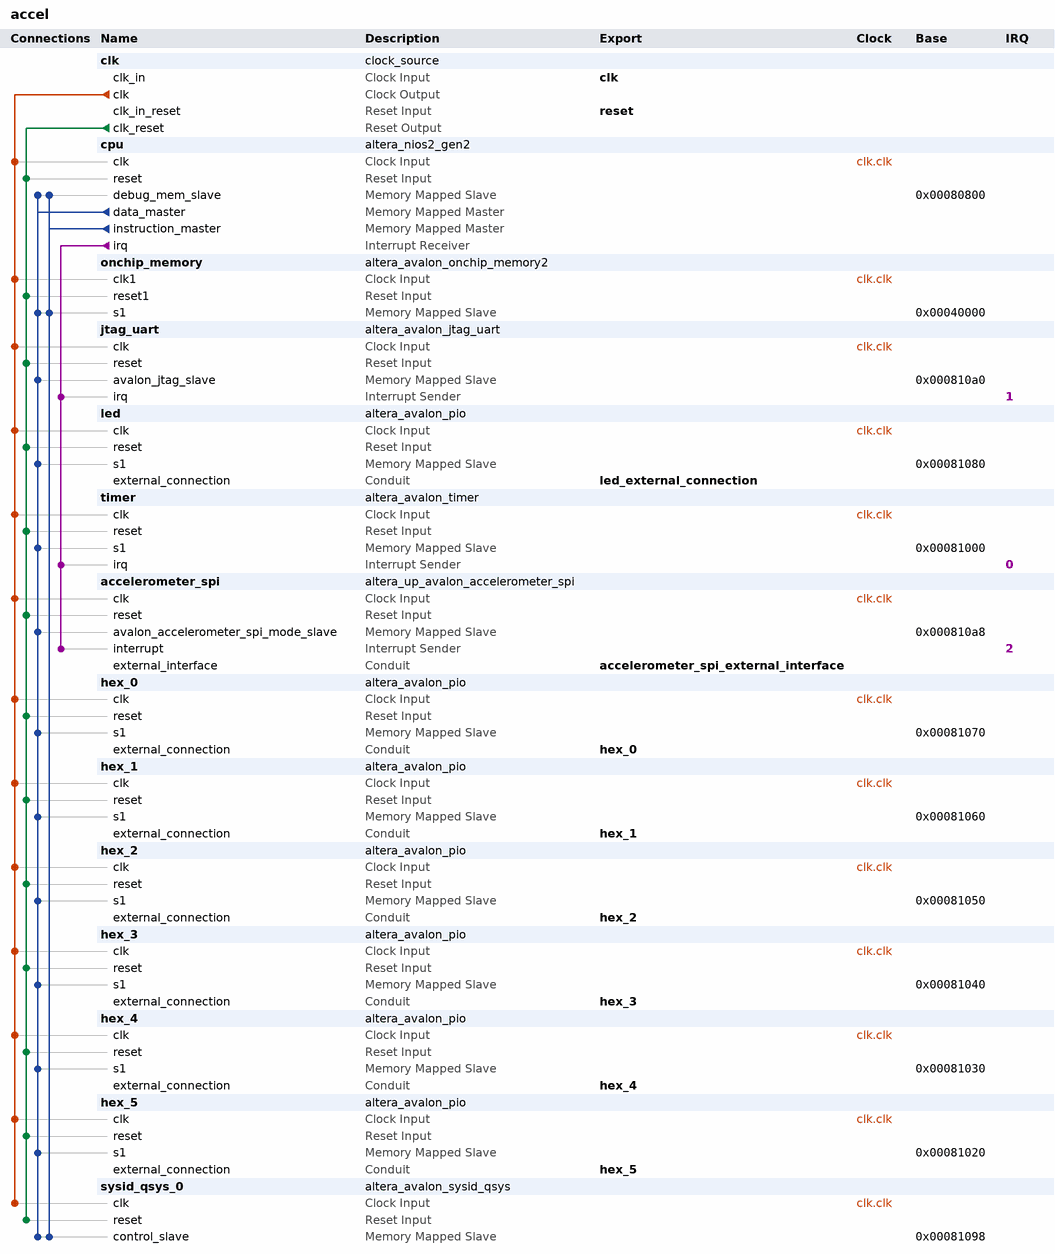
[diagram p0: system contents]
# Platform Designer (Qsys) system accel, MAX 10 10M50DAF484C7G
# Parameters at their usual value, and those the tool derives, are not listed.
package require -exact qsys 22.1
create_system accel
set_project_property DEVICE_FAMILY {MAX 10}
set_project_property DEVICE 10M50DAF484C7G

add_instance clk clock_source 22.1
set_instance_parameter_value clk clockFrequency 50000000

add_instance cpu altera_nios2_gen2 22.1
set_instance_parameter_value cpu dcache_size 2048
set_instance_parameter_value cpu exceptionSlave onchip_memory.s1
set_instance_parameter_value cpu icache_size 4096
set_instance_parameter_value cpu impl Tiny
set_instance_parameter_value cpu resetSlave onchip_memory.s1

add_instance onchip_memory altera_avalon_onchip_memory2 22.1
set_instance_parameter_value onchip_memory dataWidth 32
set_instance_parameter_value onchip_memory dualPort false
set_instance_parameter_value onchip_memory initMemContent false
set_instance_parameter_value onchip_memory initializationFileName onchip_mem.hex
set_instance_parameter_value onchip_memory memorySize 150000

add_instance jtag_uart altera_avalon_jtag_uart 22.1
set_instance_parameter_value jtag_uart simInteractiveOptions NO_INTERACTIVE_WINDOWS

add_instance led altera_avalon_pio 22.1
set_instance_parameter_value led direction Output
set_instance_parameter_value led width 10

add_instance timer altera_avalon_timer 22.1
set_instance_parameter_value timer period 1
set_instance_parameter_value timer periodUnits MSEC

add_instance accelerometer_spi altera_up_avalon_accelerometer_spi 18.0

add_instance hex_0 altera_avalon_pio 22.1
set_instance_parameter_value hex_0 direction Output
set_instance_parameter_value hex_0 width 7

add_instance hex_1 altera_avalon_pio 22.1
set_instance_parameter_value hex_1 direction Output
set_instance_parameter_value hex_1 width 7

add_instance hex_2 altera_avalon_pio 22.1
set_instance_parameter_value hex_2 direction Output
set_instance_parameter_value hex_2 width 7

add_instance hex_3 altera_avalon_pio 22.1
set_instance_parameter_value hex_3 direction Output
set_instance_parameter_value hex_3 width 7

add_instance hex_4 altera_avalon_pio 22.1
set_instance_parameter_value hex_4 direction Output
set_instance_parameter_value hex_4 width 7

add_instance hex_5 altera_avalon_pio 22.1
set_instance_parameter_value hex_5 direction Output
set_instance_parameter_value hex_5 width 7

add_instance sysid_qsys_0 altera_avalon_sysid_qsys 22.1
set_instance_parameter_value sysid_qsys_0 id 0

# connections
add_connection clk.clk accelerometer_spi.clk clock
add_connection clk.clk cpu.clk clock
add_connection clk.clk hex_0.clk clock
add_connection clk.clk hex_1.clk clock
add_connection clk.clk hex_2.clk clock
add_connection clk.clk hex_3.clk clock
add_connection clk.clk hex_4.clk clock
add_connection clk.clk hex_5.clk clock
add_connection clk.clk jtag_uart.clk clock
add_connection clk.clk led.clk clock
add_connection clk.clk onchip_memory.clk1 clock
add_connection clk.clk sysid_qsys_0.clk clock
add_connection clk.clk timer.clk clock
add_connection clk.clk_reset accelerometer_spi.reset reset
add_connection clk.clk_reset cpu.reset reset
add_connection clk.clk_reset hex_0.reset reset
add_connection clk.clk_reset hex_1.reset reset
add_connection clk.clk_reset hex_2.reset reset
add_connection clk.clk_reset hex_3.reset reset
add_connection clk.clk_reset hex_4.reset reset
add_connection clk.clk_reset hex_5.reset reset
add_connection clk.clk_reset jtag_uart.reset reset
add_connection clk.clk_reset led.reset reset
add_connection clk.clk_reset onchip_memory.reset1 reset
add_connection clk.clk_reset sysid_qsys_0.reset reset
add_connection clk.clk_reset timer.reset reset
add_connection cpu.data_master accelerometer_spi.avalon_accelerometer_spi_mode_slave avalon
set_connection_parameter_value cpu.data_master/accelerometer_spi.avalon_accelerometer_spi_mode_slave baseAddress 0x000810a8
add_connection cpu.data_master cpu.debug_mem_slave avalon
set_connection_parameter_value cpu.data_master/cpu.debug_mem_slave baseAddress 0x00080800
add_connection cpu.data_master hex_0.s1 avalon
set_connection_parameter_value cpu.data_master/hex_0.s1 baseAddress 0x00081070
add_connection cpu.data_master hex_1.s1 avalon
set_connection_parameter_value cpu.data_master/hex_1.s1 baseAddress 0x00081060
add_connection cpu.data_master hex_2.s1 avalon
set_connection_parameter_value cpu.data_master/hex_2.s1 baseAddress 0x00081050
add_connection cpu.data_master hex_3.s1 avalon
set_connection_parameter_value cpu.data_master/hex_3.s1 baseAddress 0x00081040
add_connection cpu.data_master hex_4.s1 avalon
set_connection_parameter_value cpu.data_master/hex_4.s1 baseAddress 0x00081030
add_connection cpu.data_master hex_5.s1 avalon
set_connection_parameter_value cpu.data_master/hex_5.s1 baseAddress 0x00081020
add_connection cpu.data_master jtag_uart.avalon_jtag_slave avalon
set_connection_parameter_value cpu.data_master/jtag_uart.avalon_jtag_slave baseAddress 0x000810a0
add_connection cpu.data_master led.s1 avalon
set_connection_parameter_value cpu.data_master/led.s1 baseAddress 0x00081080
add_connection cpu.data_master onchip_memory.s1 avalon
set_connection_parameter_value cpu.data_master/onchip_memory.s1 baseAddress 0x00040000
add_connection cpu.data_master sysid_qsys_0.control_slave avalon
set_connection_parameter_value cpu.data_master/sysid_qsys_0.control_slave baseAddress 0x00081098
add_connection cpu.data_master timer.s1 avalon
set_connection_parameter_value cpu.data_master/timer.s1 baseAddress 0x00081000
add_connection cpu.instruction_master cpu.debug_mem_slave avalon
set_connection_parameter_value cpu.instruction_master/cpu.debug_mem_slave baseAddress 0x00080800
add_connection cpu.instruction_master onchip_memory.s1 avalon
set_connection_parameter_value cpu.instruction_master/onchip_memory.s1 baseAddress 0x00040000
add_connection cpu.instruction_master sysid_qsys_0.control_slave avalon
set_connection_parameter_value cpu.instruction_master/sysid_qsys_0.control_slave baseAddress 0x00081098
add_connection cpu.irq accelerometer_spi.interrupt interrupt
set_connection_parameter_value cpu.irq/accelerometer_spi.interrupt irqNumber 2
add_connection cpu.irq jtag_uart.irq interrupt
set_connection_parameter_value cpu.irq/jtag_uart.irq irqNumber 1
add_connection cpu.irq timer.irq interrupt
set_connection_parameter_value cpu.irq/timer.irq irqNumber 0

# exported interfaces
add_interface accelerometer_spi_external_interface conduit end
set_interface_property accelerometer_spi_external_interface EXPORT_OF accelerometer_spi.external_interface
add_interface clk clock sink
set_interface_property clk EXPORT_OF clk.clk_in
add_interface hex_0 conduit end
set_interface_property hex_0 EXPORT_OF hex_0.external_connection
add_interface hex_1 conduit end
set_interface_property hex_1 EXPORT_OF hex_1.external_connection
add_interface hex_2 conduit end
set_interface_property hex_2 EXPORT_OF hex_2.external_connection
add_interface hex_3 conduit end
set_interface_property hex_3 EXPORT_OF hex_3.external_connection
add_interface hex_4 conduit end
set_interface_property hex_4 EXPORT_OF hex_4.external_connection
add_interface hex_5 conduit end
set_interface_property hex_5 EXPORT_OF hex_5.external_connection
add_interface led_external_connection conduit end
set_interface_property led_external_connection EXPORT_OF led.external_connection
add_interface reset reset sink
set_interface_property reset EXPORT_OF clk.clk_in_reset

set_interconnect_requirement {$system} qsys_mm.clockCrossingAdapter HANDSHAKE
set_interconnect_requirement {$system} qsys_mm.enableEccProtection FALSE
set_interconnect_requirement {$system} qsys_mm.insertDefaultSlave FALSE
set_interconnect_requirement {$system} qsys_mm.maxAdditionalLatency 1

save_system accel.qsys
